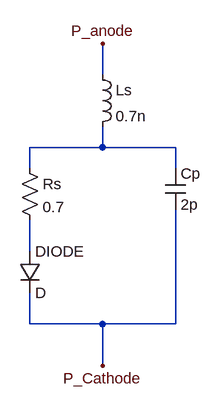
[diagram p0: schematic SMV1270.asc]
SMV1270.asc, the LTspice schematic file:
Version 4
SHEET 1 880 780
WIRE 240 160 240 112
WIRE 240 272 240 240
WIRE 240 272 128 272
WIRE 352 272 240 272
WIRE 128 304 128 272
WIRE 352 304 352 272
WIRE 128 432 128 384
WIRE 128 544 128 496
WIRE 240 544 128 544
WIRE 352 544 352 368
WIRE 352 544 240 544
WIRE 240 608 240 544
FLAG 240 112 P_anode
FLAG 240 608 P_Cathode
SYMBOL ind 224 144 R0
SYMATTR InstName Ls
SYMATTR Value 0.7n
SYMBOL res 112 288 R0
SYMATTR InstName Rs
SYMATTR Value 0.7
SYMBOL cap 336 304 R0
SYMATTR InstName Cp
SYMATTR Value 2p
SYMBOL diode 112 432 R0
SYMATTR InstName DIODE

The netlist it stands for:
* SMV1270.asc
Ls P_anode N001 0.7n
Rs N001 N002 0.7
Cp N001 P_Cathode 2p
DIODE N002 P_Cathode D
.model D D
.lib standard.dio
.backanno
.end